# Altium project Fuente.PrjPcb
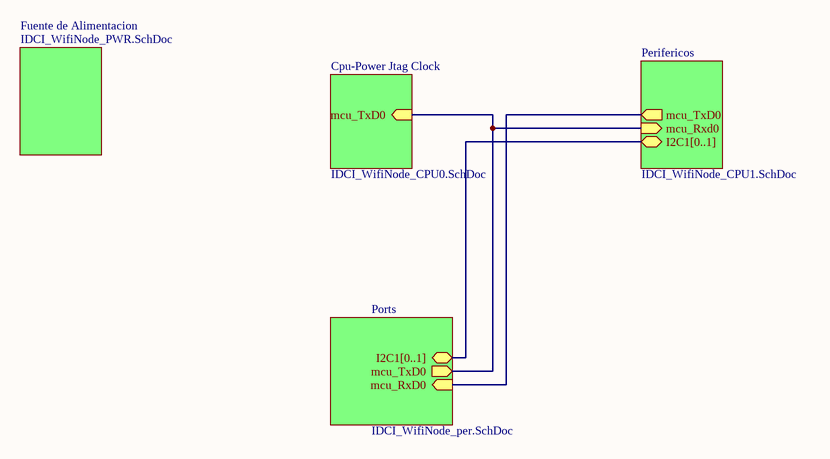
[diagram p0: IDCI_WifiNode_Blk.SchDoc]
5 sheets, 21 parts. Net scope: hierarchical (ports join the sheet entries above them; power ports are global).
Sheets:
  IDCI_WifiNode.SchDoc
  IDCI_WifiNode_Blk.SchDoc
    Cpu-Power Jtag Clock = IDCI_WifiNode_CPU0.SchDoc
    Fuente de Alimentacion = IDCI_WifiNode_PWR.SchDoc
    Perifericos = IDCI_WifiNode_CPU1.SchDoc

## Sheet IDCI_WifiNode.SchDoc
size A4

## Sheet IDCI_WifiNode_Blk.SchDoc: WifiNode
size A4; Author: Luciano Lopez; CompanyName: UTN

### Sub-sheets
Cpu-Power Jtag Clock = IDCI_WifiNode_CPU0.SchDoc: mcu_TxD0 (in)
Fuente de Alimentacion = IDCI_WifiNode_PWR.SchDoc: no entries
Perifericos = IDCI_WifiNode_CPU1.SchDoc: mcu_TxD0 (out), mcu_Rxd0 (in), I2C1[0..1] (bidir)
Ports = IDCI_WifiNode_per.SchDoc (file not in this document): mcu_TxD0 (out), mcu_RxD0 (in), I2C1[0..1] (bidir)

### Nets
NetR?_48: sheet Cpu-Power Jtag Clock/mcu_TxD0, sheet Perifericos/mcu_Rxd0, sheet Ports/mcu_TxD0
(unnamed): sheet Perifericos/mcu_TxD0, sheet Ports/mcu_RxD0

### Buses and harness runs
bus sheet Perifericos/I2C1[0..1] = sheet Ports/I2C1[0..1]

### Notes on the sheet
- Title:
- Size:
- Author:
- A4
- Sheet
- of
- Revision:
- File:
- Date:

## Sheet IDCI_WifiNode_CPU0.SchDoc
size A4
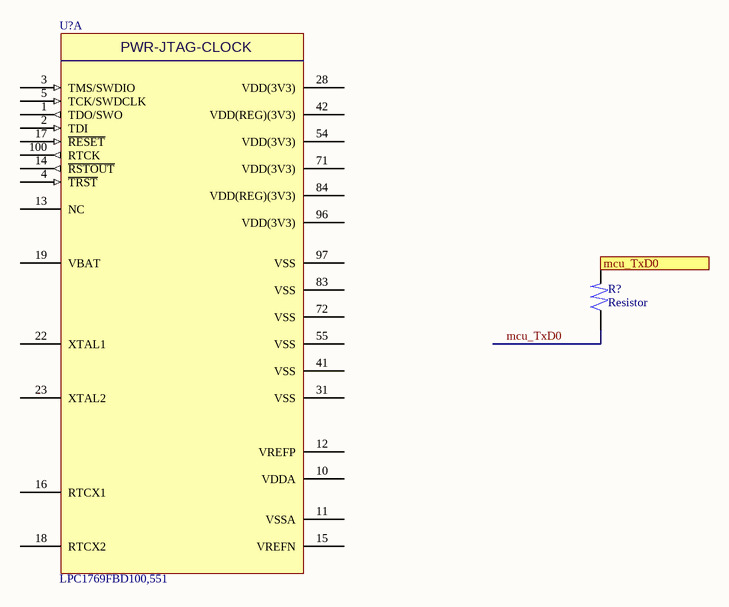
[diagram p1: IDCI_WifiNode_CPU0.SchDoc]

### Parts
(Parts that share a designator on the sheet are numbered #1, #2 ... from top to bottom, then left to right.)
R?  Resistor
U?#1  LPC1769FBD100,551  (part A of 4)

### Ports
mcu_TxD0 (in)

### Nets
mcu_TxD0: R?.47
NetR?_48: R?.48 ; port mcu_TxD0

Not connected (* = marked no-connect by the designer): U?#1 1(TDO/SWO) 2(TDI) 3(TMS/SWDIO) 4(~{TRST}) 5(TCK/SWDCLK) 10(VDDA) 11(VSSA) 12(VREFP) 13(NC) 14(~{RSTOUT}) 15(VREFN) 16(RTCX1) 17(~{RESET}) 18(RTCX2) 19(VBAT) 22(XTAL1) 23(XTAL2) 28(VDD(3V3)) 31(VSS) 41(VSS) 42(VDD(REG)(3V3)) 54(VDD(3V3)) 55(VSS) 71(VDD(3V3)) 72(VSS) 83(VSS) 84(VDD(REG)(3V3)) 96(VDD(3V3)) 97(VSS) 100(RTCK)

### Notes on the sheet
- Title:
- Size:
- Author:
- A4
- Sheet
- of
- Revision:
- File:
- Date:
- (in symbol LPC1769FBD100_Multipart, part A) PWR-JTAG-CLOCK

### Library data of the parts
U?#1 = LPC1769FBD100_Multipart: Mcu Cortex M3 LQFP100

## Sheet IDCI_WifiNode_PWR.SchDoc
size A4
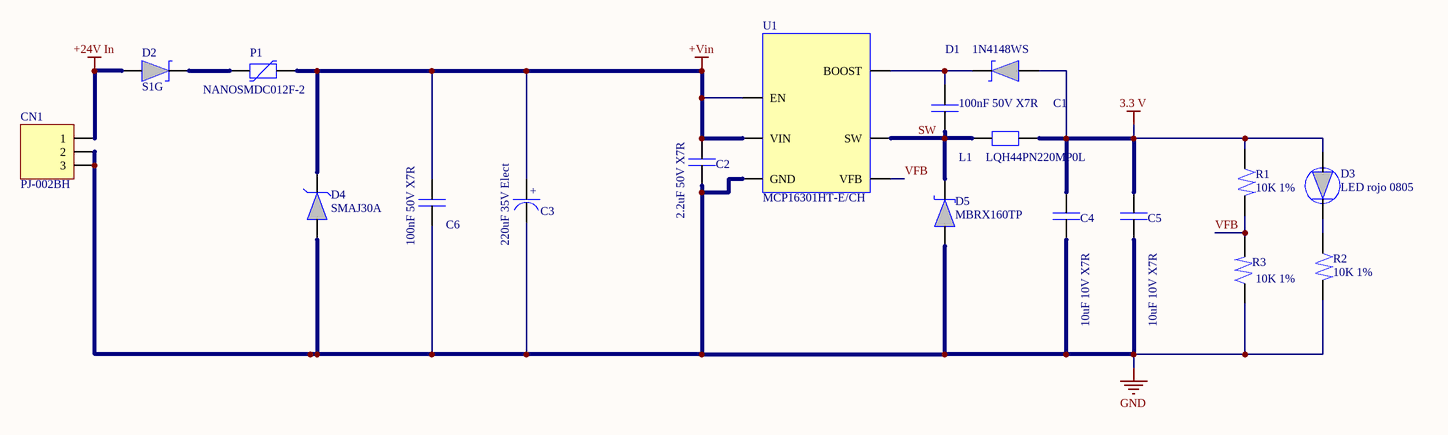
[diagram p2: IDCI_WifiNode_PWR.SchDoc]

### Parts
C1  100nF 50V X7R
C2  2.2uF 50V X7R
C3  220uF 35V Elect
C4  10uF 10V X7R
C5  10uF 10V X7R
C6  100nF 50V X7R
CN1  PJ-002BH
D1  1N4148WS
D2  S1G
D3  LED rojo 0805
D4  SMAJ30A
D5  MBRX160TP
L1  LQH44PN220MP0L
P1  NANOSMDC012F-2
R1  10K 1%
R2  10K 1%
R3  10K 1%
U1  MCP16301HT-E/CH

### Nets
3.3 V: C4.39 C5.39 D1.34 D3.31 L1.46 R1.47
+24V In: CN1.42(1) D2.34
+Vin: C2.39 C3.36 C6.39 D4.33 P1.40 U1.49(EN) U1.50(VIN)
GND: C2.38 C3.37 C4.38 C5.38 C6.38 CN1.43(2) CN1.44(3) D4.32 D5.34 R2.48 R3.47 U1.51(GND)
SW: C1.38 D5.35 L1.45 U1.52(SW)
VFB: R1.48 R3.48 U1.54(VFB)
NetC1_39: C1.39 D1.35 U1.53(BOOST)
NetD2_35: D2.35 P1.41
NetD3_30: D3.30 R2.47

### Notes on the sheet
- Title:
- Size:
- Author:
- A4
- Sheet
- of
- Revision:
- File:
- Date:
- (in symbol POL_CAP) +

### Library data of the parts
C1 C2 C4-C6 = CAPACITOR: Capacitor AF
C3 = POL_CAP: Capacitor polarizado
CN1 = Connector
D1 D2 D5 = TVS_DIODE
D3 = LED_DIODE
D4 = ZENER_DIODE
L1 = Inductor
P1 = Polyswitch
R1-R3 = Resistor
U1 = Integrado: Driver Switching

## Sheet IDCI_WifiNode_CPU1.SchDoc
size A4
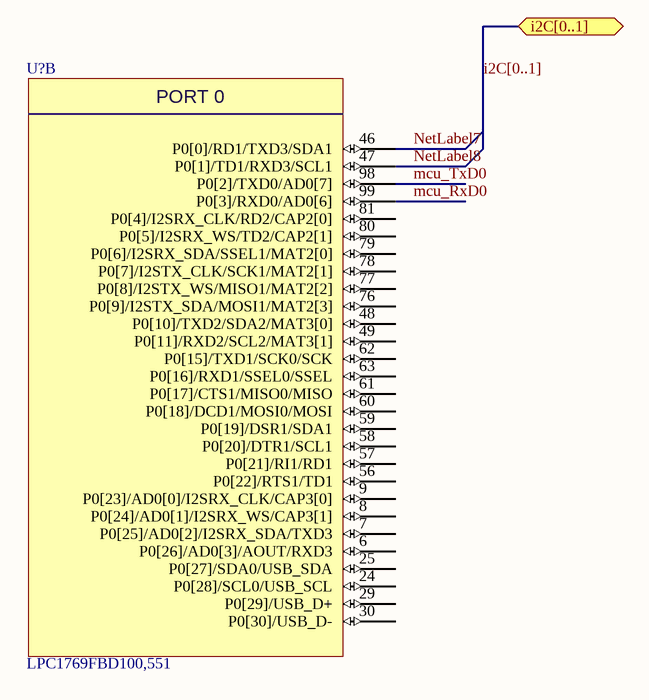
[diagram p3: IDCI_WifiNode_CPU1.SchDoc]

### Parts
(Parts that share a designator on the sheet are numbered #1, #2 ... from top to bottom, then left to right.)
U?#2  LPC1769FBD100,551  (part B of 4)

### Ports
i2C[0..1] (bidir)

### Nets
mcu_RxD0: U?#2.99(P0[3]/RXD0/AD0[6])
mcu_TxD0: U?#2.98(P0[2]/TXD0/AD0[7])
NetLabel7: U?#2.46(P0[0]/RD1/TXD3/SDA1)
NetLabel8: U?#2.47(P0[1]/TD1/RXD3/SCL1)

Not connected (* = marked no-connect by the designer): U?#2 6(P0[26]/AD0[3]/AOUT/RXD3) 7(P0[25]/AD0[2]/I2SRX_SDA/TXD3) 8(P0[24]/AD0[1]/I2SRX_WS/CAP3[1]) 9(P0[23]/AD0[0]/I2SRX_CLK/CAP3[0]) 24(P0[28]/SCL0/USB_SCL) 25(P0[27]/SDA0/USB_SDA) 29(P0[29]/USB_D+) 30(P0[30]/USB_D-) 48(P0[10]/TXD2/SDA2/MAT3[0]) 49(P0[11]/RXD2/SCL2/MAT3[1]) 56(P0[22]/RTS1/TD1) 57(P0[21]/RI1/RD1) 58(P0[20]/DTR1/SCL1) 59(P0[19]/DSR1/SDA1) 60(P0[18]/DCD1/MOSI0/MOSI) 61(P0[17]/CTS1/MISO0/MISO) 62(P0[15]/TXD1/SCK0/SCK) 63(P0[16]/RXD1/SSEL0/SSEL) 76(P0[9]/I2STX_SDA/MOSI1/MAT2[3]) 77(P0[8]/I2STX_WS/MISO1/MAT2[2]) 78(P0[7]/I2STX_CLK/SCK1/MAT2[1]) 79(P0[6]/I2SRX_SDA/SSEL1/MAT2[0]) 80(P0[5]/I2SRX_WS/TD2/CAP2[1]) 81(P0[4]/I2SRX_CLK/RD2/CAP2[0])

### Buses and harness runs
bus i2C[0..1] = port i2C[0..1]

### Notes on the sheet
- Title:
- Size:
- Author:
- A4
- Sheet
- of
- Revision:
- File:
- Date:
- (in symbol LPC1769FBD100_Multipart, part B) PORT 0
- (in symbol LPC1769FBD100_Multipart, part C) PORT 1
- (in symbol LPC1769FBD100_Multipart, part D) PORT 2 - 3 - 4

### Library data of the parts
U?#2 = LPC1769FBD100_Multipart: Mcu Cortex M3 LQFP100